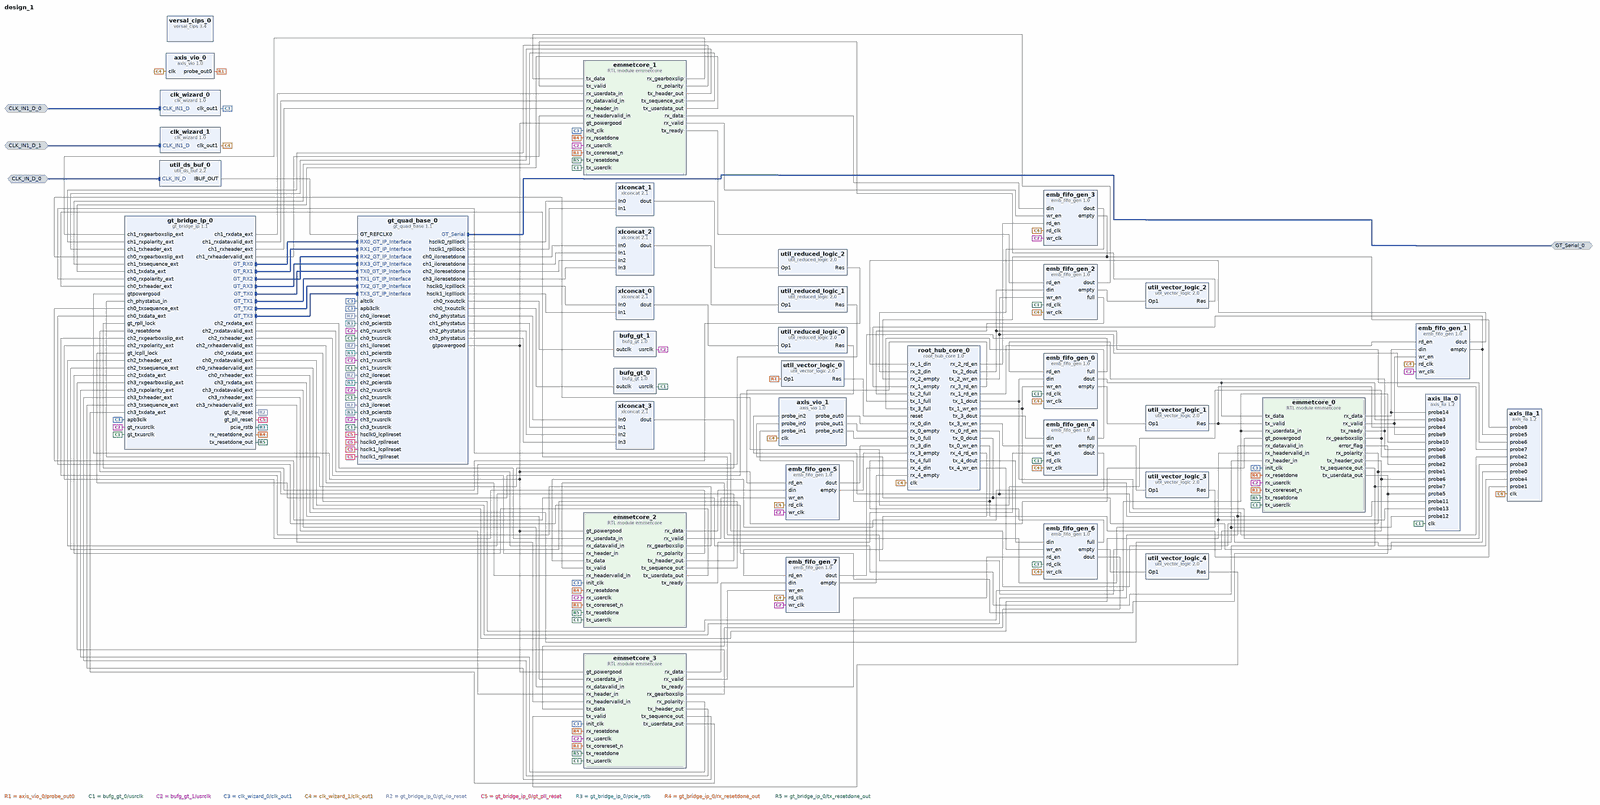
[diagram p0: block diagram of the top level, whole]
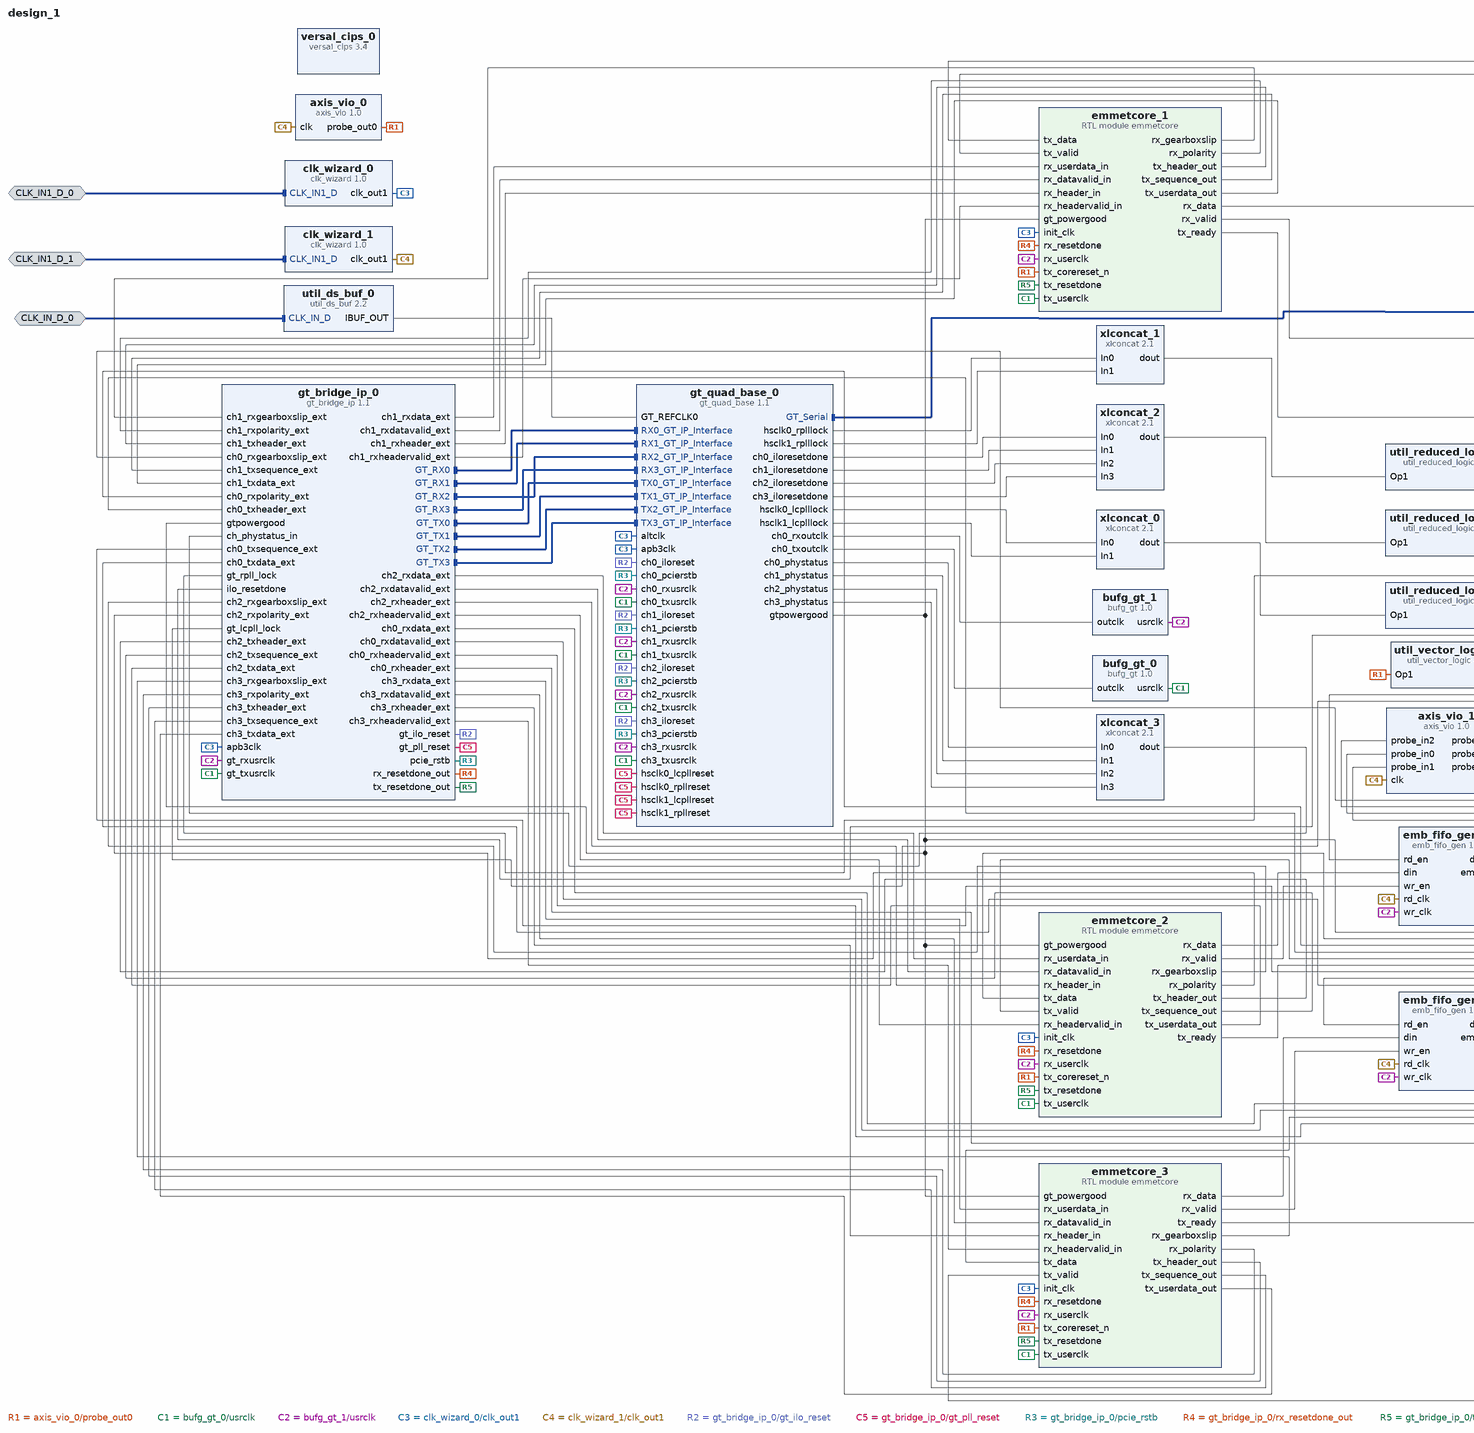
[diagram p1: block diagram of the top level, left part]
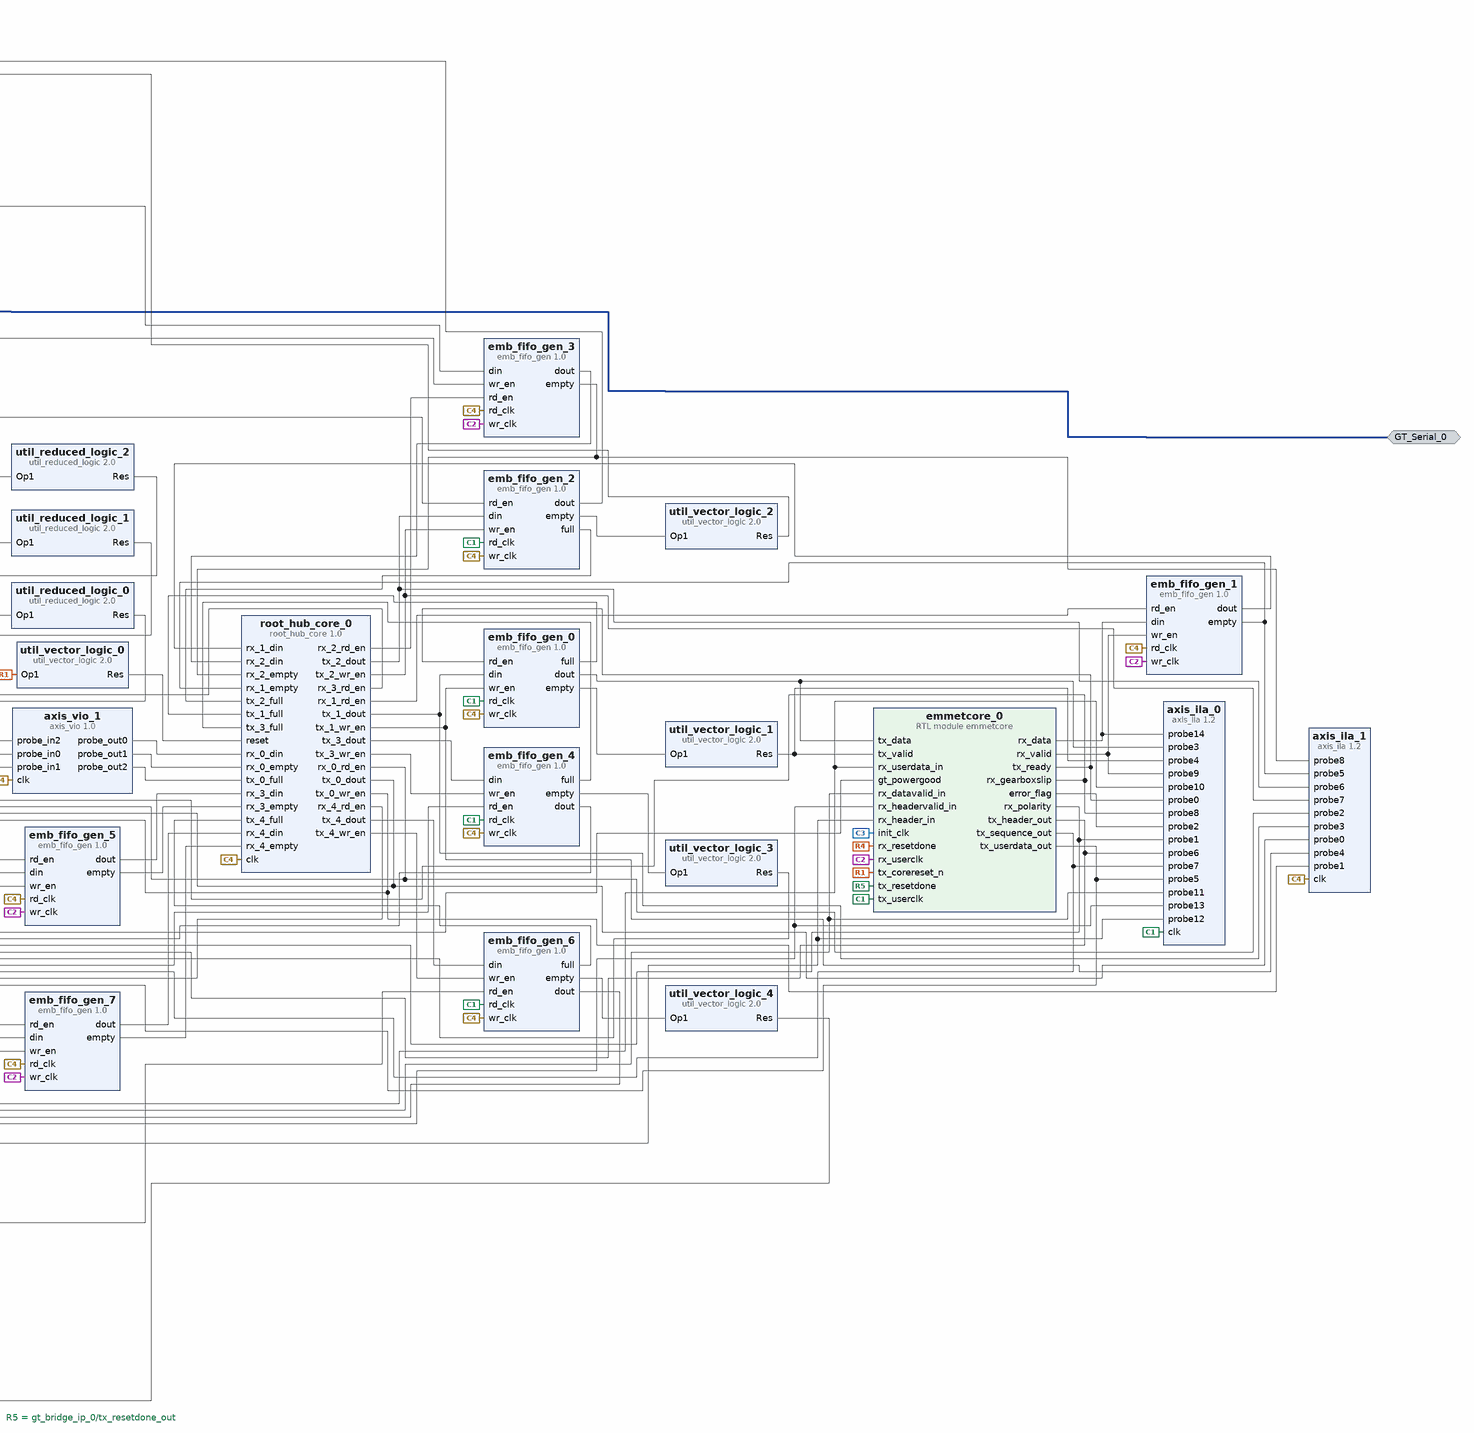
[diagram p2: block diagram of the top level, right part]
# Vivado block design design_1, xcvm1802-vsva2197-2MP-e-S, Vivado 2023.2
create_bd_design design_1

create_bd_intf_port -mode Master -vlnv xilinx.com:interface:gt_rtl:1.0 GT_Serial_0
create_bd_intf_port -mode Slave -vlnv xilinx.com:interface:diff_clock_rtl:1.0 CLK_IN_D_0
create_bd_intf_port -mode Slave -vlnv xilinx.com:interface:diff_clock_rtl:1.0 CLK_IN1_D_0
set_property -dict {CONFIG.FREQ_HZ 200000000} [get_bd_intf_ports CLK_IN1_D_0]
create_bd_intf_port -mode Slave -vlnv xilinx.com:interface:diff_clock_rtl:1.0 CLK_IN1_D_1
set_property -dict {CONFIG.FREQ_HZ 200000000} [get_bd_intf_ports CLK_IN1_D_1]

create_bd_cell -type ip -vlnv xilinx.com:ip:gt_bridge_ip:1.1 gt_bridge_ip_0
set_property -dict [list \
  CONFIG.BYPASS_MODE true \
  CONFIG.IP_LR0_SETTINGS {['PRESET GTY-Aurora_64B66B RX_PAM_SEL NRZ TX_PAM_SEL NRZ TX_HD_EN 0 RX_HD_EN 0 RX_GRAY_BYP true TX_GRAY_BYP true RX_GRAY_LITTLEENDIAN true TX_GRAY_LITTLEENDIAN true RX_PRECODE_BYP true TX_PRECODE_BYP', 'true RX_PRECODE_LITTLEENDIAN false TX_PRECODE_LITTLEENDIAN false INTERNAL_PRESET Aurora_64B66B GT_TYPE GTY GT_DIRECTION DUPLEX TX_LINE_RATE 16 TX_PLL_TYPE LCPLL TX_REFCLK_FREQUENCY 100', 'TX_ACTUAL_REFCLK_FREQUENCY 100.000000000000 TX_FRACN_ENABLED false TX_FRACN_OVRD false TX_FRACN_NUMERATOR 0 TX_REFCLK_SOURCE R0 TX_DATA_ENCODING 64B66B_SYNC TX_USER_DATA_WIDTH 64 TX_INT_DATA_WIDTH 64', 'TX_BUFFER_MODE 1 TX_BUFFER_BYPASS_MODE Fast_Sync TX_PIPM_ENABLE false TX_OUTCLK_SOURCE TXOUTCLKPMA TXPROGDIV_FREQ_ENABLE false TXPROGDIV_FREQ_SOURCE LCPLL TXPROGDIV_FREQ_VAL 250.000000', 'TX_DIFF_SWING_EMPH_MODE CUSTOM TX_64B66B_SCRAMBLER false TX_64B66B_ENCODER false TX_64B66B_CRC false TX_RATE_GROUP A RX_LINE_RATE 16 RX_PLL_TYPE LCPLL RX_REFCLK_FREQUENCY 100', 'RX_ACTUAL_REFCLK_FREQUENCY 100.000000000000 RX_FRACN_ENABLED false RX_FRACN_OVRD false RX_FRACN_NUMERATOR 0 RX_REFCLK_SOURCE R0 RX_DATA_DECODING 64B66B_SYNC RX_USER_DATA_WIDTH 64 RX_INT_DATA_WIDTH 64', 'RX_BUFFER_MODE 1 RX_OUTCLK_SOURCE RXOUTCLKPMA RXPROGDIV_FREQ_ENABLE false RXPROGDIV_FREQ_SOURCE LCPLL RXPROGDIV_FREQ_VAL 250.000000 RXRECCLK_FREQ_ENABLE false RXRECCLK_FREQ_VAL 0 INS_LOSS_NYQ 20', 'RX_EQ_MODE AUTO RX_COUPLING AC RX_TERMINATION PROGRAMMABLE RX_RATE_GROUP A RX_TERMINATION_PROG_VALUE 800 RX_PPM_OFFSET 0 RX_64B66B_DESCRAMBLER false RX_64B66B_DECODER false RX_64B66B_CRC false', 'OOB_ENABLE false RX_COMMA_ALIGN_WORD 1 RX_COMMA_SHOW_REALIGN_ENABLE true PCIE_ENABLE false TX_LANE_DESKEW_HDMI_ENABLE false RX_COMMA_P_ENABLE false RX_COMMA_M_ENABLE false RX_COMMA_DOUBLE_ENABLE false', 'RX_COMMA_P_VAL 0101111100 RX_COMMA_M_VAL 1010000011 RX_COMMA_MASK 0000000000 RX_SLIDE_MODE OFF RX_SSC_PPM 0 RX_CB_NUM_SEQ 0 RX_CB_LEN_SEQ 1 RX_CB_MAX_SKEW 1 RX_CB_MAX_LEVEL 1 RX_CB_MASK_0_0 false', 'RX_CB_VAL_0_0 00000000 RX_CB_K_0_0 false RX_CB_DISP_0_0 false RX_CB_MASK_0_1 false RX_CB_VAL_0_1 00000000 RX_CB_K_0_1 false RX_CB_DISP_0_1 false RX_CB_MASK_0_2 false RX_CB_VAL_0_2 00000000 RX_CB_K_0_2', 'false RX_CB_DISP_0_2 false RX_CB_MASK_0_3 false RX_CB_VAL_0_3 00000000 RX_CB_K_0_3 false RX_CB_DISP_0_3 false RX_CB_MASK_1_0 false RX_CB_VAL_1_0 00000000 RX_CB_K_1_0 false RX_CB_DISP_1_0 false', 'RX_CB_MASK_1_1 false RX_CB_VAL_1_1 00000000 RX_CB_K_1_1 false RX_CB_DISP_1_1 false RX_CB_MASK_1_2 false RX_CB_VAL_1_2 00000000 RX_CB_K_1_2 false RX_CB_DISP_1_2 false RX_CB_MASK_1_3 false RX_CB_VAL_1_3', '00000000 RX_CB_K_1_3 false RX_CB_DISP_1_3 false RX_CC_NUM_SEQ 0 RX_CC_LEN_SEQ 1 RX_CC_PERIODICITY 5000 RX_CC_KEEP_IDLE DISABLE RX_CC_PRECEDENCE ENABLE RX_CC_REPEAT_WAIT 0 RX_CC_VAL', '00000000000000000000000000000000000000000000000000000000000000000000000000000000 RX_CC_MASK_0_0 false RX_CC_VAL_0_0 00000000 RX_CC_K_0_0 false RX_CC_DISP_0_0 false RX_CC_MASK_0_1 false RX_CC_VAL_0_1', '00000000 RX_CC_K_0_1 false RX_CC_DISP_0_1 false RX_CC_MASK_0_2 false RX_CC_VAL_0_2 00000000 RX_CC_K_0_2 false RX_CC_DISP_0_2 false RX_CC_MASK_0_3 false RX_CC_VAL_0_3 00000000 RX_CC_K_0_3 false', 'RX_CC_DISP_0_3 false RX_CC_MASK_1_0 false RX_CC_VAL_1_0 00000000 RX_CC_K_1_0 false RX_CC_DISP_1_0 false RX_CC_MASK_1_1 false RX_CC_VAL_1_1 00000000 RX_CC_K_1_1 false RX_CC_DISP_1_1 false', 'RX_CC_MASK_1_2 false RX_CC_VAL_1_2 00000000 RX_CC_K_1_2 false RX_CC_DISP_1_2 false RX_CC_MASK_1_3 false RX_CC_VAL_1_3 00000000 RX_CC_K_1_3 false RX_CC_DISP_1_3 false PCIE_USERCLK2_FREQ 250', 'PCIE_USERCLK_FREQ 250 RX_JTOL_FC 9.5980804 RX_JTOL_LF_SLOPE -20 RX_BUFFER_BYPASS_MODE Fast_Sync RX_BUFFER_BYPASS_MODE_LANE MULTI RX_BUFFER_RESET_ON_CB_CHANGE ENABLE RX_BUFFER_RESET_ON_COMMAALIGN', 'DISABLE RX_BUFFER_RESET_ON_RATE_CHANGE ENABLE TX_BUFFER_RESET_ON_RATE_CHANGE ENABLE RESET_SEQUENCE_INTERVAL 0 RX_COMMA_PRESET NONE RX_COMMA_VALID_ONLY 0']} \
  CONFIG.IP_NO_OF_LANES 4 \
  CONFIG.IP_PRESET GTY-Aurora_64B66B \
] [get_bd_cells gt_bridge_ip_0]
create_bd_cell -type ip -vlnv xilinx.com:ip:gt_quad_base:1.1 gt_quad_base_0
set_property -dict [list \
  CONFIG.APB3_CLK_FREQUENCY 200.0 \
  CONFIG.BYPASS_DRC_58G false \
  CONFIG.CHANNEL_ORDERING {['/gt_quad_base_0/TX0_GT_IP_Interface design_1_gt_bridge_ip_0_0./gt_bridge_ip_0/GT_TX0.0 /gt_quad_base_0/TX1_GT_IP_Interface design_1_gt_bridge_ip_0_0./gt_bridge_ip_0/GT_TX1.1', '/gt_quad_base_0/TX2_GT_IP_Interface design_1_gt_bridge_ip_0_0./gt_bridge_ip_0/GT_TX2.2 /gt_quad_base_0/TX3_GT_IP_Interface design_1_gt_bridge_ip_0_0./gt_bridge_ip_0/GT_TX3.3', '/gt_quad_base_0/RX0_GT_IP_Interface design_1_gt_bridge_ip_0_0./gt_bridge_ip_0/GT_RX0.0 /gt_quad_base_0/RX1_GT_IP_Interface design_1_gt_bridge_ip_0_0./gt_bridge_ip_0/GT_RX1.1', '/gt_quad_base_0/RX2_GT_IP_Interface design_1_gt_bridge_ip_0_0./gt_bridge_ip_0/GT_RX2.2 /gt_quad_base_0/RX3_GT_IP_Interface design_1_gt_bridge_ip_0_0./gt_bridge_ip_0/GT_RX3.3']} \
  CONFIG.GT_TYPE GTY \
  CONFIG.PORTS_INFO_DICT {LANE_SEL_DICT {PROT0 {RX0 RX1 RX2 RX3 TX0 TX1 TX2 TX3}} GT_TYPE GTY REG_CONF_INTF APB3_INTF BOARD_PARAMETER { }} \
  CONFIG.PROT0_ENABLE true \
  CONFIG.PROT0_GT_DIRECTION DUPLEX \
  CONFIG.PROT0_LR0_SETTINGS {['RX_CB_MASK 00000000 RX_CB_VAL 00000000000000000000000000000000000000000000000000000000000000000000000000000000 RX_CB_K 00000000 RX_CB_DISP 00000000 RX_CC_MASK 00000000 RX_CC_K 00000000 RX_CC_DISP', '00000000 GT_DIRECTION DUPLEX TX_PAM_SEL NRZ TX_HD_EN 0 TX_GRAY_BYP true TX_GRAY_LITTLEENDIAN true TX_PRECODE_BYP true TX_PRECODE_LITTLEENDIAN false TX_LINE_RATE 16 TX_PLL_TYPE LCPLL', 'TX_REFCLK_FREQUENCY 100 TX_ACTUAL_REFCLK_FREQUENCY 100.000000000000 TX_FRACN_ENABLED false TX_FRACN_OVRD false TX_FRACN_NUMERATOR 0 TX_REFCLK_SOURCE R0 TX_DATA_ENCODING 64B66B_SYNC TX_USER_DATA_WIDTH', '64 TX_INT_DATA_WIDTH 64 TX_BUFFER_MODE 1 TX_BUFFER_BYPASS_MODE Fast_Sync TX_PIPM_ENABLE false TX_OUTCLK_SOURCE TXOUTCLKPMA TXPROGDIV_FREQ_ENABLE false TXPROGDIV_FREQ_SOURCE LCPLL TXPROGDIV_FREQ_VAL', '250.000000 TX_DIFF_SWING_EMPH_MODE CUSTOM TX_64B66B_SCRAMBLER false TX_64B66B_ENCODER false TX_64B66B_CRC false TX_RATE_GROUP A TX_LANE_DESKEW_HDMI_ENABLE false TX_BUFFER_RESET_ON_RATE_CHANGE ENABLE', 'PRESET GTY-Aurora_64B66B RX_PAM_SEL NRZ RX_HD_EN 0 RX_GRAY_BYP true RX_GRAY_LITTLEENDIAN true RX_PRECODE_BYP true RX_PRECODE_LITTLEENDIAN false INTERNAL_PRESET Aurora_64B66B RX_LINE_RATE 16', 'RX_PLL_TYPE LCPLL RX_REFCLK_FREQUENCY 100 RX_ACTUAL_REFCLK_FREQUENCY 100.000000000000 RX_FRACN_ENABLED false RX_FRACN_OVRD false RX_FRACN_NUMERATOR 0 RX_REFCLK_SOURCE R0 RX_DATA_DECODING 64B66B_SYNC', 'RX_USER_DATA_WIDTH 64 RX_INT_DATA_WIDTH 64 RX_BUFFER_MODE 1 RX_OUTCLK_SOURCE RXOUTCLKPMA RXPROGDIV_FREQ_ENABLE false RXPROGDIV_FREQ_SOURCE LCPLL RXPROGDIV_FREQ_VAL 250.000000 RXRECCLK_FREQ_ENABLE', 'false RXRECCLK_FREQ_VAL 0 INS_LOSS_NYQ 20 RX_EQ_MODE AUTO RX_COUPLING AC RX_TERMINATION PROGRAMMABLE RX_RATE_GROUP A RX_TERMINATION_PROG_VALUE 800 RX_PPM_OFFSET 0 RX_64B66B_DESCRAMBLER false', 'RX_64B66B_DECODER false RX_64B66B_CRC false OOB_ENABLE false RX_COMMA_ALIGN_WORD 1 RX_COMMA_SHOW_REALIGN_ENABLE true PCIE_ENABLE false RX_COMMA_P_ENABLE false RX_COMMA_M_ENABLE false', 'RX_COMMA_DOUBLE_ENABLE false RX_COMMA_P_VAL 0101111100 RX_COMMA_M_VAL 1010000011 RX_COMMA_MASK 0000000000 RX_SLIDE_MODE OFF RX_SSC_PPM 0 RX_CB_NUM_SEQ 0 RX_CB_LEN_SEQ 1 RX_CB_MAX_SKEW 1', 'RX_CB_MAX_LEVEL 1 RX_CB_MASK_0_0 false RX_CB_VAL_0_0 00000000 RX_CB_K_0_0 false RX_CB_DISP_0_0 false RX_CB_MASK_0_1 false RX_CB_VAL_0_1 00000000 RX_CB_K_0_1 false RX_CB_DISP_0_1 false RX_CB_MASK_0_2', 'false RX_CB_VAL_0_2 00000000 RX_CB_K_0_2 false RX_CB_DISP_0_2 false RX_CB_MASK_0_3 false RX_CB_VAL_0_3 00000000 RX_CB_K_0_3 false RX_CB_DISP_0_3 false RX_CB_MASK_1_0 false RX_CB_VAL_1_0 00000000', 'RX_CB_K_1_0 false RX_CB_DISP_1_0 false RX_CB_MASK_1_1 false RX_CB_VAL_1_1 00000000 RX_CB_K_1_1 false RX_CB_DISP_1_1 false RX_CB_MASK_1_2 false RX_CB_VAL_1_2 00000000 RX_CB_K_1_2 false RX_CB_DISP_1_2', 'false RX_CB_MASK_1_3 false RX_CB_VAL_1_3 00000000 RX_CB_K_1_3 false RX_CB_DISP_1_3 false RX_CC_NUM_SEQ 0 RX_CC_LEN_SEQ 1 RX_CC_PERIODICITY 5000 RX_CC_KEEP_IDLE DISABLE RX_CC_PRECEDENCE ENABLE', 'RX_CC_REPEAT_WAIT 0 RX_CC_VAL 00000000000000000000000000000000000000000000000000000000000000000000000000000000 RX_CC_MASK_0_0 false RX_CC_VAL_0_0 00000000 RX_CC_K_0_0 false RX_CC_DISP_0_0 false', 'RX_CC_MASK_0_1 false RX_CC_VAL_0_1 00000000 RX_CC_K_0_1 false RX_CC_DISP_0_1 false RX_CC_MASK_0_2 false RX_CC_VAL_0_2 00000000 RX_CC_K_0_2 false RX_CC_DISP_0_2 false RX_CC_MASK_0_3 false RX_CC_VAL_0_3', '00000000 RX_CC_K_0_3 false RX_CC_DISP_0_3 false RX_CC_MASK_1_0 false RX_CC_VAL_1_0 00000000 RX_CC_K_1_0 false RX_CC_DISP_1_0 false RX_CC_MASK_1_1 false RX_CC_VAL_1_1 00000000 RX_CC_K_1_1 false', 'RX_CC_DISP_1_1 false RX_CC_MASK_1_2 false RX_CC_VAL_1_2 00000000 RX_CC_K_1_2 false RX_CC_DISP_1_2 false RX_CC_MASK_1_3 false RX_CC_VAL_1_3 00000000 RX_CC_K_1_3 false RX_CC_DISP_1_3 false', 'PCIE_USERCLK2_FREQ 250 PCIE_USERCLK_FREQ 250 RX_JTOL_FC 9.5980804 RX_JTOL_LF_SLOPE -20 RX_BUFFER_BYPASS_MODE Fast_Sync RX_BUFFER_BYPASS_MODE_LANE MULTI RX_BUFFER_RESET_ON_CB_CHANGE ENABLE', 'RX_BUFFER_RESET_ON_COMMAALIGN DISABLE RX_BUFFER_RESET_ON_RATE_CHANGE ENABLE RESET_SEQUENCE_INTERVAL 0 RX_COMMA_PRESET NONE RX_COMMA_VALID_ONLY 0 GT_TYPE GTY']} \
  CONFIG.PROT0_LR10_SETTINGS {NA NA} \
  CONFIG.PROT0_LR11_SETTINGS {NA NA} \
  CONFIG.PROT0_LR12_SETTINGS {NA NA} \
  CONFIG.PROT0_LR13_SETTINGS {NA NA} \
  CONFIG.PROT0_LR14_SETTINGS {NA NA} \
  CONFIG.PROT0_LR15_SETTINGS {NA NA} \
  CONFIG.PROT0_LR1_SETTINGS {NA NA} \
  CONFIG.PROT0_LR2_SETTINGS {NA NA} \
  CONFIG.PROT0_LR3_SETTINGS {NA NA} \
  CONFIG.PROT0_LR4_SETTINGS {NA NA} \
  CONFIG.PROT0_LR5_SETTINGS {NA NA} \
  CONFIG.PROT0_LR6_SETTINGS {NA NA} \
  CONFIG.PROT0_LR7_SETTINGS {NA NA} \
  CONFIG.PROT0_LR8_SETTINGS {NA NA} \
  CONFIG.PROT0_LR9_SETTINGS {NA NA} \
  CONFIG.PROT0_NO_OF_LANES 4 \
  CONFIG.PROT0_RX_MASTERCLK_SRC RX0 \
  CONFIG.PROT0_TX_MASTERCLK_SRC TX0 \
  CONFIG.QUAD_USAGE {['TX_QUAD_CH {', 'TXQuad_0_/gt_quad_base_0 {/gt_quad_base_0 design_1_gt_bridge_ip_0_0.IP_CH0,design_1_gt_bridge_ip_0_0.IP_CH1,design_1_gt_bridge_ip_0_0.IP_CH2,design_1_gt_bridge_ip_0_0.IP_CH3 MSTRCLK 1,0,0,0', 'IS_CURRENT_QUAD 1}', '}', 'RX_QUAD_CH {', 'RXQuad_0_/gt_quad_base_0 {/gt_quad_base_0 design_1_gt_bridge_ip_0_0.IP_CH0,design_1_gt_bridge_ip_0_0.IP_CH1,design_1_gt_bridge_ip_0_0.IP_CH2,design_1_gt_bridge_ip_0_0.IP_CH3 MSTRCLK 1,0,0,0', 'IS_CURRENT_QUAD 1}', '}']} \
  CONFIG.REFCLK_LIST {{/CLK_IN_D_0_clk_p[0]}} \
  CONFIG.REFCLK_STRING {HSCLK0_LCPLLGTREFCLK0 refclk_PROT0_R0_100_MHz_unique1 HSCLK1_LCPLLGTREFCLK0 refclk_PROT0_R0_100_MHz_unique1} \
  CONFIG.REG_CONF_INTF APB3_INTF \
  CONFIG.RX0_LANE_SEL PROT0 \
  CONFIG.RX1_LANE_SEL PROT0 \
  CONFIG.RX2_LANE_SEL PROT0 \
  CONFIG.RX3_LANE_SEL PROT0 \
  CONFIG.TX0_LANE_SEL PROT0 \
  CONFIG.TX1_LANE_SEL PROT0 \
  CONFIG.TX2_LANE_SEL PROT0 \
  CONFIG.TX3_LANE_SEL PROT0 \
] [get_bd_cells gt_quad_base_0]
create_bd_cell -type ip -vlnv xilinx.com:ip:bufg_gt:1.0 bufg_gt_0
create_bd_cell -type ip -vlnv xilinx.com:ip:bufg_gt:1.0 bufg_gt_1
create_bd_cell -type ip -vlnv xilinx.com:ip:clk_wizard:1.0 clk_wizard_0
set_property -dict [list \
  CONFIG.CLKOUT_DRIVES BUFG,BUFG,BUFG,BUFG,BUFG,BUFG,BUFG \
  CONFIG.CLKOUT_DYN_PS None,None,None,None,None,None,None \
  CONFIG.CLKOUT_GROUPING Auto,Auto,Auto,Auto,Auto,Auto,Auto \
  CONFIG.CLKOUT_MATCHED_ROUTING false,false,false,false,false,false,false \
  CONFIG.CLKOUT_PORT clk_out1,clk_out2,clk_out3,clk_out4,clk_out5,clk_out6,clk_out7 \
  CONFIG.CLKOUT_REQUESTED_DUTY_CYCLE 50.000,50.000,50.000,50.000,50.000,50.000,50.000 \
  CONFIG.CLKOUT_REQUESTED_OUT_FREQUENCY 200.000,100.000,100.000,100.000,100.000,100.000,100.000 \
  CONFIG.CLKOUT_REQUESTED_PHASE 0.000,0.000,0.000,0.000,0.000,0.000,0.000 \
  CONFIG.CLKOUT_USED true,false,false,false,false,false,false \
  CONFIG.PRIM_IN_FREQ 200 \
  CONFIG.PRIM_SOURCE Differential_clock_capable_pin \
] [get_bd_cells clk_wizard_0]
create_bd_cell -type ip -vlnv xilinx.com:ip:util_ds_buf:2.2 util_ds_buf_0
set_property -dict {CONFIG.C_BUF_TYPE IBUFDSGTE} [get_bd_cells util_ds_buf_0]
create_bd_cell -type ip -vlnv xilinx.com:ip:xlconcat:2.1 xlconcat_0
create_bd_cell -type ip -vlnv xilinx.com:ip:xlconcat:2.1 xlconcat_1
create_bd_cell -type ip -vlnv xilinx.com:ip:xlconcat:2.1 xlconcat_2
set_property -dict {CONFIG.NUM_PORTS 4} [get_bd_cells xlconcat_2]
create_bd_cell -type ip -vlnv xilinx.com:ip:util_reduced_logic:2.0 util_reduced_logic_0
set_property -dict {CONFIG.C_SIZE 2} [get_bd_cells util_reduced_logic_0]
create_bd_cell -type ip -vlnv xilinx.com:ip:util_reduced_logic:2.0 util_reduced_logic_1
set_property -dict {CONFIG.C_SIZE 4} [get_bd_cells util_reduced_logic_1]
create_bd_cell -type ip -vlnv xilinx.com:ip:util_reduced_logic:2.0 util_reduced_logic_2
set_property -dict {CONFIG.C_SIZE 2} [get_bd_cells util_reduced_logic_2]
create_bd_cell -type ip -vlnv xilinx.com:ip:xlconcat:2.1 xlconcat_3
set_property -dict {CONFIG.NUM_PORTS 4} [get_bd_cells xlconcat_3]
create_bd_cell -type module -reference emmetcore emmetcore_0
create_bd_cell -type ip -vlnv xilinx.com:ip:axis_vio:1.0 axis_vio_0
set_property -dict [list \
  CONFIG.C_NUM_PROBE_IN 0 \
  CONFIG.C_NUM_PROBE_OUT 1 \
  CONFIG.C_PROBE_OUT1_WIDTH 1 \
  CONFIG.C_PROBE_OUT2_WIDTH 1 \
] [get_bd_cells axis_vio_0]
create_bd_cell -type ip -vlnv xilinx.com:ip:clk_wizard:1.0 clk_wizard_1
set_property -dict {CONFIG.PRIM_IN_FREQ 200 CONFIG.PRIM_SOURCE Differential_clock_capable_pin} [get_bd_cells clk_wizard_1]
create_bd_cell -type ip -vlnv xilinx.com:ip:emb_fifo_gen:1.0 emb_fifo_gen_0
set_property -dict [list \
  CONFIG.CDC_SYNC_STAGES 2 \
  CONFIG.CLOCK_DOMAIN Independent_Clock \
  CONFIG.READ_MODE FWFT \
  CONFIG.WRITE_DATA_WIDTH 64 \
] [get_bd_cells emb_fifo_gen_0]
create_bd_cell -type ip -vlnv xilinx.com:ip:util_vector_logic:2.0 util_vector_logic_1
set_property -dict {CONFIG.C_OPERATION not CONFIG.C_SIZE 1} [get_bd_cells util_vector_logic_1]
create_bd_cell -type ip -vlnv xilinx.com:ip:axis_ila:1.2 axis_ila_0
set_property -dict [list \
  CONFIG.C_NUM_OF_PROBES 15 \
  CONFIG.C_PROBE10_WIDTH 64 \
  CONFIG.C_PROBE12_WIDTH 2 \
  CONFIG.C_PROBE14_WIDTH 64 \
  CONFIG.C_PROBE18_WIDTH 1 \
  CONFIG.C_PROBE20_WIDTH 1 \
  CONFIG.C_PROBE22_WIDTH 1 \
  CONFIG.C_PROBE23_WIDTH 1 \
  CONFIG.C_PROBE3_WIDTH 64 \
  CONFIG.C_PROBE5_WIDTH 64 \
  CONFIG.C_PROBE6_WIDTH 2 \
  CONFIG.C_PROBE7_WIDTH 7 \
  CONFIG.C_PROBE8_WIDTH 1 \
] [get_bd_cells axis_ila_0]
create_bd_cell -type ip -vlnv xilinx.com:ip:versal_cips:3.4 versal_cips_0
create_bd_cell -type ip -vlnv user.org:user:root_hub_core:1.0 root_hub_core_0
set_property -dict {CONFIG.NUM_FPGAS 5} [get_bd_cells root_hub_core_0]
create_bd_cell -type ip -vlnv xilinx.com:ip:axis_vio:1.0 axis_vio_1
set_property -dict [list \
  CONFIG.C_NUM_PROBE_IN 3 \
  CONFIG.C_NUM_PROBE_OUT 3 \
  CONFIG.C_PROBE_IN0_WIDTH 64 \
  CONFIG.C_PROBE_OUT0_WIDTH 64 \
] [get_bd_cells axis_vio_1]
create_bd_cell -type ip -vlnv xilinx.com:ip:axis_ila:1.2 axis_ila_1
set_property -dict [list \
  CONFIG.C_NUM_OF_PROBES 9 \
  CONFIG.C_PROBE0_WIDTH 64 \
  CONFIG.C_PROBE3_WIDTH 64 \
  CONFIG.C_PROBE6_WIDTH 64 \
] [get_bd_cells axis_ila_1]
create_bd_cell -type ip -vlnv xilinx.com:ip:emb_fifo_gen:1.0 emb_fifo_gen_1
set_property -dict [list \
  CONFIG.CLOCK_DOMAIN Independent_Clock \
  CONFIG.READ_MODE FWFT \
  CONFIG.WRITE_DATA_WIDTH 64 \
] [get_bd_cells emb_fifo_gen_1]
create_bd_cell -type ip -vlnv xilinx.com:ip:util_vector_logic:2.0 util_vector_logic_0
set_property -dict {CONFIG.C_OPERATION not CONFIG.C_SIZE 1} [get_bd_cells util_vector_logic_0]
create_bd_cell -type module -reference emmetcore emmetcore_1
create_bd_cell -type ip -vlnv xilinx.com:ip:emb_fifo_gen:1.0 emb_fifo_gen_2
set_property -dict [list \
  CONFIG.CLOCK_DOMAIN Independent_Clock \
  CONFIG.READ_MODE FWFT \
  CONFIG.WRITE_DATA_WIDTH 64 \
] [get_bd_cells emb_fifo_gen_2]
create_bd_cell -type ip -vlnv xilinx.com:ip:emb_fifo_gen:1.0 emb_fifo_gen_3
set_property -dict [list \
  CONFIG.CLOCK_DOMAIN Independent_Clock \
  CONFIG.READ_MODE FWFT \
  CONFIG.WRITE_DATA_WIDTH 64 \
] [get_bd_cells emb_fifo_gen_3]
create_bd_cell -type ip -vlnv xilinx.com:ip:util_vector_logic:2.0 util_vector_logic_2
set_property -dict {CONFIG.C_OPERATION not CONFIG.C_SIZE 1} [get_bd_cells util_vector_logic_2]
create_bd_cell -type module -reference emmetcore emmetcore_2
create_bd_cell -type ip -vlnv xilinx.com:ip:emb_fifo_gen:1.0 emb_fifo_gen_4
set_property -dict [list \
  CONFIG.CLOCK_DOMAIN Independent_Clock \
  CONFIG.READ_MODE FWFT \
  CONFIG.WRITE_DATA_WIDTH 64 \
] [get_bd_cells emb_fifo_gen_4]
create_bd_cell -type ip -vlnv xilinx.com:ip:emb_fifo_gen:1.0 emb_fifo_gen_5
set_property -dict [list \
  CONFIG.CLOCK_DOMAIN Independent_Clock \
  CONFIG.READ_MODE FWFT \
  CONFIG.WRITE_DATA_WIDTH 64 \
] [get_bd_cells emb_fifo_gen_5]
create_bd_cell -type ip -vlnv xilinx.com:ip:util_vector_logic:2.0 util_vector_logic_3
set_property -dict {CONFIG.C_OPERATION not CONFIG.C_SIZE 1} [get_bd_cells util_vector_logic_3]
create_bd_cell -type module -reference emmetcore emmetcore_3
create_bd_cell -type ip -vlnv xilinx.com:ip:emb_fifo_gen:1.0 emb_fifo_gen_6
set_property -dict [list \
  CONFIG.CLOCK_DOMAIN Independent_Clock \
  CONFIG.READ_MODE FWFT \
  CONFIG.WRITE_DATA_WIDTH 64 \
] [get_bd_cells emb_fifo_gen_6]
create_bd_cell -type ip -vlnv xilinx.com:ip:emb_fifo_gen:1.0 emb_fifo_gen_7
set_property -dict [list \
  CONFIG.CLOCK_DOMAIN Independent_Clock \
  CONFIG.READ_MODE FWFT \
  CONFIG.WRITE_DATA_WIDTH 64 \
] [get_bd_cells emb_fifo_gen_7]
create_bd_cell -type ip -vlnv xilinx.com:ip:util_vector_logic:2.0 util_vector_logic_4
set_property -dict {CONFIG.C_OPERATION not CONFIG.C_SIZE 1} [get_bd_cells util_vector_logic_4]

# ---- connections ----

connect_bd_intf_net -intf_net CLK_IN1_D_0_1 [get_bd_intf_ports CLK_IN1_D_0] [get_bd_intf_pins clk_wizard_0/CLK_IN1_D]
connect_bd_intf_net -intf_net CLK_IN1_D_1_1 [get_bd_intf_ports CLK_IN1_D_1] [get_bd_intf_pins clk_wizard_1/CLK_IN1_D]
connect_bd_intf_net -intf_net CLK_IN_D_0_1 [get_bd_intf_ports CLK_IN_D_0] [get_bd_intf_pins util_ds_buf_0/CLK_IN_D]
connect_bd_intf_net [get_bd_intf_pins gt_bridge_ip_0/GT_RX0] [get_bd_intf_pins gt_quad_base_0/RX0_GT_IP_Interface]
connect_bd_intf_net [get_bd_intf_pins gt_bridge_ip_0/GT_RX1] [get_bd_intf_pins gt_quad_base_0/RX1_GT_IP_Interface]
connect_bd_intf_net [get_bd_intf_pins gt_bridge_ip_0/GT_RX2] [get_bd_intf_pins gt_quad_base_0/RX2_GT_IP_Interface]
connect_bd_intf_net [get_bd_intf_pins gt_bridge_ip_0/GT_RX3] [get_bd_intf_pins gt_quad_base_0/RX3_GT_IP_Interface]
connect_bd_intf_net [get_bd_intf_pins gt_bridge_ip_0/GT_TX0] [get_bd_intf_pins gt_quad_base_0/TX0_GT_IP_Interface]
connect_bd_intf_net [get_bd_intf_pins gt_bridge_ip_0/GT_TX1] [get_bd_intf_pins gt_quad_base_0/TX1_GT_IP_Interface]
connect_bd_intf_net [get_bd_intf_pins gt_bridge_ip_0/GT_TX2] [get_bd_intf_pins gt_quad_base_0/TX2_GT_IP_Interface]
connect_bd_intf_net [get_bd_intf_pins gt_bridge_ip_0/GT_TX3] [get_bd_intf_pins gt_quad_base_0/TX3_GT_IP_Interface]
connect_bd_intf_net [get_bd_intf_ports GT_Serial_0] [get_bd_intf_pins gt_quad_base_0/GT_Serial]
connect_bd_net [get_bd_pins axis_vio_0/probe_out0] \
  [get_bd_pins util_vector_logic_0/Op1] [get_bd_pins emmetcore_0/tx_corereset_n] [get_bd_pins emmetcore_1/tx_corereset_n] \
  [get_bd_pins emmetcore_2/tx_corereset_n] [get_bd_pins emmetcore_3/tx_corereset_n]
connect_bd_net [get_bd_pins axis_vio_1/probe_out0] [get_bd_pins root_hub_core_0/rx_0_din]
connect_bd_net [get_bd_pins axis_vio_1/probe_out1] [get_bd_pins root_hub_core_0/rx_0_empty]
connect_bd_net [get_bd_pins axis_vio_1/probe_out2] [get_bd_pins root_hub_core_0/tx_0_full]
connect_bd_net [get_bd_pins bufg_gt_0/usrclk] \
  [get_bd_pins gt_bridge_ip_0/gt_txusrclk] [get_bd_pins gt_quad_base_0/ch0_txusrclk] \
  [get_bd_pins gt_quad_base_0/ch3_txusrclk] [get_bd_pins gt_quad_base_0/ch1_txusrclk] \
  [get_bd_pins gt_quad_base_0/ch2_txusrclk] [get_bd_pins emb_fifo_gen_0/rd_clk] [get_bd_pins axis_ila_0/clk] \
  [get_bd_pins emb_fifo_gen_2/rd_clk] [get_bd_pins emb_fifo_gen_4/rd_clk] [get_bd_pins emb_fifo_gen_6/rd_clk] \
  [get_bd_pins emmetcore_0/tx_userclk] [get_bd_pins emmetcore_1/tx_userclk] [get_bd_pins emmetcore_2/tx_userclk] \
  [get_bd_pins emmetcore_3/tx_userclk]
connect_bd_net [get_bd_pins bufg_gt_1/usrclk] \
  [get_bd_pins gt_bridge_ip_0/gt_rxusrclk] [get_bd_pins gt_quad_base_0/ch3_rxusrclk] \
  [get_bd_pins gt_quad_base_0/ch0_rxusrclk] [get_bd_pins gt_quad_base_0/ch2_rxusrclk] \
  [get_bd_pins gt_quad_base_0/ch1_rxusrclk] [get_bd_pins emb_fifo_gen_1/wr_clk] [get_bd_pins emb_fifo_gen_3/wr_clk] \
  [get_bd_pins emb_fifo_gen_5/wr_clk] [get_bd_pins emb_fifo_gen_7/wr_clk] [get_bd_pins emmetcore_0/rx_userclk] \
  [get_bd_pins emmetcore_1/rx_userclk] [get_bd_pins emmetcore_2/rx_userclk] [get_bd_pins emmetcore_3/rx_userclk]
connect_bd_net [get_bd_pins clk_wizard_0/clk_out1] \
  [get_bd_pins gt_quad_base_0/apb3clk] [get_bd_pins gt_bridge_ip_0/apb3clk] [get_bd_pins gt_quad_base_0/altclk] \
  [get_bd_pins emmetcore_0/init_clk] [get_bd_pins emmetcore_1/init_clk] [get_bd_pins emmetcore_2/init_clk] \
  [get_bd_pins emmetcore_3/init_clk]
connect_bd_net [get_bd_pins clk_wizard_1/clk_out1] \
  [get_bd_pins emb_fifo_gen_0/wr_clk] [get_bd_pins axis_vio_0/clk] [get_bd_pins emb_fifo_gen_1/rd_clk] \
  [get_bd_pins axis_ila_1/clk] [get_bd_pins axis_vio_1/clk] [get_bd_pins root_hub_core_0/clk] \
  [get_bd_pins emb_fifo_gen_2/wr_clk] [get_bd_pins emb_fifo_gen_3/rd_clk] [get_bd_pins emb_fifo_gen_4/wr_clk] \
  [get_bd_pins emb_fifo_gen_5/rd_clk] [get_bd_pins emb_fifo_gen_7/rd_clk] [get_bd_pins emb_fifo_gen_6/wr_clk]
connect_bd_net [get_bd_pins emb_fifo_gen_0/dout] [get_bd_pins axis_ila_0/probe3] [get_bd_pins emmetcore_0/tx_data]
connect_bd_net [get_bd_pins emb_fifo_gen_0/empty] [get_bd_pins util_vector_logic_1/Op1]
connect_bd_net [get_bd_pins emb_fifo_gen_0/full] [get_bd_pins root_hub_core_0/tx_1_full]
connect_bd_net [get_bd_pins emb_fifo_gen_1/dout] [get_bd_pins root_hub_core_0/rx_1_din]
connect_bd_net [get_bd_pins emb_fifo_gen_1/empty] [get_bd_pins root_hub_core_0/rx_1_empty] [get_bd_pins axis_ila_1/probe5]
connect_bd_net [get_bd_pins emb_fifo_gen_2/dout] [get_bd_pins emmetcore_1/tx_data]
connect_bd_net [get_bd_pins emb_fifo_gen_2/empty] [get_bd_pins util_vector_logic_2/Op1]
connect_bd_net [get_bd_pins emb_fifo_gen_2/full] [get_bd_pins root_hub_core_0/tx_2_full]
connect_bd_net [get_bd_pins emb_fifo_gen_3/dout] [get_bd_pins root_hub_core_0/rx_2_din]
connect_bd_net [get_bd_pins emb_fifo_gen_3/empty] [get_bd_pins root_hub_core_0/rx_2_empty] [get_bd_pins axis_ila_1/probe8]
connect_bd_net [get_bd_pins emb_fifo_gen_4/dout] [get_bd_pins emmetcore_2/tx_data]
connect_bd_net [get_bd_pins emb_fifo_gen_4/empty] [get_bd_pins util_vector_logic_3/Op1]
connect_bd_net [get_bd_pins emb_fifo_gen_4/full] [get_bd_pins root_hub_core_0/tx_3_full]
connect_bd_net [get_bd_pins emb_fifo_gen_5/dout] [get_bd_pins root_hub_core_0/rx_3_din]
connect_bd_net [get_bd_pins emb_fifo_gen_5/empty] [get_bd_pins root_hub_core_0/rx_3_empty]
connect_bd_net [get_bd_pins emb_fifo_gen_6/dout] [get_bd_pins emmetcore_3/tx_data]
connect_bd_net [get_bd_pins emb_fifo_gen_6/empty] [get_bd_pins util_vector_logic_4/Op1]
connect_bd_net [get_bd_pins emb_fifo_gen_6/full] [get_bd_pins root_hub_core_0/tx_4_full]
connect_bd_net [get_bd_pins emb_fifo_gen_7/dout] [get_bd_pins root_hub_core_0/rx_4_din]
connect_bd_net [get_bd_pins emb_fifo_gen_7/empty] [get_bd_pins root_hub_core_0/rx_4_empty]
connect_bd_net [get_bd_pins emmetcore_0/error_flag] [get_bd_pins axis_ila_0/probe2]
connect_bd_net [get_bd_pins emmetcore_0/rx_data] [get_bd_pins axis_ila_0/probe14] [get_bd_pins emb_fifo_gen_1/din]
connect_bd_net [get_bd_pins emmetcore_0/rx_gearboxslip] [get_bd_pins gt_bridge_ip_0/ch0_rxgearboxslip_ext] [get_bd_pins axis_ila_0/probe8]
connect_bd_net [get_bd_pins emmetcore_0/rx_polarity] [get_bd_pins gt_bridge_ip_0/ch0_rxpolarity_ext] [get_bd_pins axis_ila_0/probe1]
connect_bd_net [get_bd_pins emmetcore_0/rx_valid] [get_bd_pins emb_fifo_gen_1/wr_en] [get_bd_pins axis_ila_0/probe9]
connect_bd_net [get_bd_pins emmetcore_0/tx_header_out] [get_bd_pins gt_bridge_ip_0/ch0_txheader_ext] [get_bd_pins axis_ila_0/probe6]
connect_bd_net [get_bd_pins emmetcore_0/tx_ready] [get_bd_pins emb_fifo_gen_0/rd_en] [get_bd_pins axis_ila_0/probe0]
connect_bd_net [get_bd_pins emmetcore_0/tx_sequence_out] [get_bd_pins gt_bridge_ip_0/ch0_txsequence_ext] [get_bd_pins axis_ila_0/probe7]
connect_bd_net [get_bd_pins emmetcore_0/tx_userdata_out] [get_bd_pins gt_bridge_ip_0/ch0_txdata_ext] [get_bd_pins axis_ila_0/probe5]
connect_bd_net [get_bd_pins emmetcore_1/rx_data] [get_bd_pins emb_fifo_gen_3/din]
connect_bd_net [get_bd_pins emmetcore_1/rx_gearboxslip] [get_bd_pins gt_bridge_ip_0/ch1_rxgearboxslip_ext]
connect_bd_net [get_bd_pins emmetcore_1/rx_polarity] [get_bd_pins gt_bridge_ip_0/ch1_rxpolarity_ext]
connect_bd_net [get_bd_pins emmetcore_1/rx_valid] [get_bd_pins emb_fifo_gen_3/wr_en]
connect_bd_net [get_bd_pins emmetcore_1/tx_header_out] [get_bd_pins gt_bridge_ip_0/ch1_txheader_ext]
connect_bd_net [get_bd_pins emmetcore_1/tx_ready] [get_bd_pins emb_fifo_gen_2/rd_en]
connect_bd_net [get_bd_pins emmetcore_1/tx_sequence_out] [get_bd_pins gt_bridge_ip_0/ch1_txsequence_ext]
connect_bd_net [get_bd_pins emmetcore_1/tx_userdata_out] [get_bd_pins gt_bridge_ip_0/ch1_txdata_ext]
connect_bd_net [get_bd_pins emmetcore_2/rx_data] [get_bd_pins emb_fifo_gen_5/din]
connect_bd_net [get_bd_pins emmetcore_2/rx_gearboxslip] [get_bd_pins gt_bridge_ip_0/ch2_rxgearboxslip_ext]
connect_bd_net [get_bd_pins emmetcore_2/rx_polarity] [get_bd_pins gt_bridge_ip_0/ch2_rxpolarity_ext]
connect_bd_net [get_bd_pins emmetcore_2/rx_valid] [get_bd_pins emb_fifo_gen_5/wr_en]
connect_bd_net [get_bd_pins emmetcore_2/tx_header_out] [get_bd_pins gt_bridge_ip_0/ch2_txheader_ext]
connect_bd_net [get_bd_pins emmetcore_2/tx_ready] [get_bd_pins emb_fifo_gen_4/rd_en]
connect_bd_net [get_bd_pins emmetcore_2/tx_sequence_out] [get_bd_pins gt_bridge_ip_0/ch2_txsequence_ext]
connect_bd_net [get_bd_pins emmetcore_2/tx_userdata_out] [get_bd_pins gt_bridge_ip_0/ch2_txdata_ext]
connect_bd_net [get_bd_pins emmetcore_3/rx_data] [get_bd_pins emb_fifo_gen_7/din]
connect_bd_net [get_bd_pins emmetcore_3/rx_gearboxslip] [get_bd_pins gt_bridge_ip_0/ch3_rxgearboxslip_ext]
connect_bd_net [get_bd_pins emmetcore_3/rx_polarity] [get_bd_pins gt_bridge_ip_0/ch3_rxpolarity_ext]
connect_bd_net [get_bd_pins emmetcore_3/rx_valid] [get_bd_pins emb_fifo_gen_7/wr_en]
connect_bd_net [get_bd_pins emmetcore_3/tx_header_out] [get_bd_pins gt_bridge_ip_0/ch3_txheader_ext]
connect_bd_net [get_bd_pins emmetcore_3/tx_ready] [get_bd_pins emb_fifo_gen_6/rd_en]
connect_bd_net [get_bd_pins emmetcore_3/tx_sequence_out] [get_bd_pins gt_bridge_ip_0/ch3_txsequence_ext]
connect_bd_net [get_bd_pins emmetcore_3/tx_userdata_out] [get_bd_pins gt_bridge_ip_0/ch3_txdata_ext]
connect_bd_net [get_bd_pins gt_bridge_ip_0/ch0_rxdata_ext] [get_bd_pins axis_ila_0/probe10] [get_bd_pins emmetcore_0/rx_userdata_in]
connect_bd_net [get_bd_pins gt_bridge_ip_0/ch0_rxdatavalid_ext] [get_bd_pins axis_ila_0/probe11] [get_bd_pins emmetcore_0/rx_datavalid_in]
connect_bd_net [get_bd_pins gt_bridge_ip_0/ch0_rxheadervalid_ext] [get_bd_pins axis_ila_0/probe13] [get_bd_pins emmetcore_0/rx_headervalid_in]
connect_bd_net [get_bd_pins gt_bridge_ip_0/ch1_rxdata_ext] [get_bd_pins emmetcore_1/rx_userdata_in]
connect_bd_net [get_bd_pins gt_bridge_ip_0/ch1_rxdatavalid_ext] [get_bd_pins emmetcore_1/rx_datavalid_in]
connect_bd_net [get_bd_pins gt_bridge_ip_0/ch1_rxheader_ext] [get_bd_pins emmetcore_1/rx_header_in]
connect_bd_net [get_bd_pins gt_bridge_ip_0/ch1_rxheadervalid_ext] [get_bd_pins emmetcore_1/rx_headervalid_in]
connect_bd_net [get_bd_pins gt_bridge_ip_0/ch2_rxdata_ext] [get_bd_pins emmetcore_2/rx_userdata_in]
connect_bd_net [get_bd_pins gt_bridge_ip_0/ch2_rxdatavalid_ext] [get_bd_pins emmetcore_2/rx_datavalid_in]
connect_bd_net [get_bd_pins gt_bridge_ip_0/ch2_rxheader_ext] [get_bd_pins emmetcore_2/rx_header_in]
connect_bd_net [get_bd_pins gt_bridge_ip_0/ch2_rxheadervalid_ext] [get_bd_pins emmetcore_2/rx_headervalid_in]
connect_bd_net [get_bd_pins gt_bridge_ip_0/ch3_rxdata_ext] [get_bd_pins emmetcore_3/rx_userdata_in]
connect_bd_net [get_bd_pins gt_bridge_ip_0/ch3_rxdatavalid_ext] [get_bd_pins emmetcore_3/rx_datavalid_in]
connect_bd_net [get_bd_pins gt_bridge_ip_0/ch3_rxheader_ext] [get_bd_pins emmetcore_3/rx_header_in]
connect_bd_net [get_bd_pins gt_bridge_ip_0/ch3_rxheadervalid_ext] [get_bd_pins emmetcore_3/rx_headervalid_in]
connect_bd_net [get_bd_pins gt_bridge_ip_0/gt_ilo_reset] \
  [get_bd_pins gt_quad_base_0/ch0_iloreset] [get_bd_pins gt_quad_base_0/ch1_iloreset] \
  [get_bd_pins gt_quad_base_0/ch2_iloreset] [get_bd_pins gt_quad_base_0/ch3_iloreset]
connect_bd_net [get_bd_pins gt_bridge_ip_0/gt_pll_reset] \
  [get_bd_pins gt_quad_base_0/hsclk0_lcpllreset] [get_bd_pins gt_quad_base_0/hsclk0_rpllreset] \
  [get_bd_pins gt_quad_base_0/hsclk1_lcpllreset] [get_bd_pins gt_quad_base_0/hsclk1_rpllreset]
connect_bd_net [get_bd_pins gt_bridge_ip_0/pcie_rstb] \
  [get_bd_pins gt_quad_base_0/ch0_pcierstb] [get_bd_pins gt_quad_base_0/ch1_pcierstb] \
  [get_bd_pins gt_quad_base_0/ch2_pcierstb] [get_bd_pins gt_quad_base_0/ch3_pcierstb]
connect_bd_net [get_bd_pins gt_bridge_ip_0/rx_resetdone_out] \
  [get_bd_pins emmetcore_0/rx_resetdone] [get_bd_pins emmetcore_1/rx_resetdone] [get_bd_pins emmetcore_2/rx_resetdone] \
  [get_bd_pins emmetcore_3/rx_resetdone]
connect_bd_net [get_bd_pins gt_bridge_ip_0/tx_resetdone_out] \
  [get_bd_pins emmetcore_0/tx_resetdone] [get_bd_pins emmetcore_1/tx_resetdone] [get_bd_pins emmetcore_2/tx_resetdone] \
  [get_bd_pins emmetcore_3/tx_resetdone]
connect_bd_net [get_bd_pins gt_quad_base_0/ch0_iloresetdone] [get_bd_pins xlconcat_2/In0]
connect_bd_net [get_bd_pins gt_quad_base_0/ch0_phystatus] [get_bd_pins xlconcat_3/In0]
connect_bd_net [get_bd_pins gt_quad_base_0/ch0_rxoutclk] [get_bd_pins bufg_gt_1/outclk]
connect_bd_net [get_bd_pins gt_quad_base_0/ch0_txoutclk] [get_bd_pins bufg_gt_0/outclk]
connect_bd_net [get_bd_pins gt_quad_base_0/ch1_iloresetdone] [get_bd_pins xlconcat_2/In1]
connect_bd_net [get_bd_pins gt_quad_base_0/ch1_phystatus] [get_bd_pins xlconcat_3/In1]
connect_bd_net [get_bd_pins gt_quad_base_0/ch2_iloresetdone] [get_bd_pins xlconcat_2/In2]
connect_bd_net [get_bd_pins gt_quad_base_0/ch2_phystatus] [get_bd_pins xlconcat_3/In2]
connect_bd_net [get_bd_pins gt_quad_base_0/ch3_iloresetdone] [get_bd_pins xlconcat_2/In3]
connect_bd_net [get_bd_pins gt_quad_base_0/ch3_phystatus] [get_bd_pins xlconcat_3/In3]
connect_bd_net [get_bd_pins gt_quad_base_0/gtpowergood] \
  [get_bd_pins gt_bridge_ip_0/gtpowergood] [get_bd_pins emmetcore_0/gt_powergood] [get_bd_pins emmetcore_1/gt_powergood] \
  [get_bd_pins emmetcore_2/gt_powergood] [get_bd_pins emmetcore_3/gt_powergood]
connect_bd_net [get_bd_pins gt_quad_base_0/hsclk0_lcplllock] [get_bd_pins xlconcat_0/In0]
connect_bd_net [get_bd_pins gt_quad_base_0/hsclk0_rplllock] [get_bd_pins xlconcat_1/In0]
connect_bd_net [get_bd_pins gt_quad_base_0/hsclk1_lcplllock] [get_bd_pins xlconcat_0/In1]
connect_bd_net [get_bd_pins gt_quad_base_0/hsclk1_rplllock] [get_bd_pins xlconcat_1/In1]
connect_bd_net -net inverter_0_rx_header_out [get_bd_pins gt_bridge_ip_0/ch0_rxheader_ext] \
  [get_bd_pins axis_ila_0/probe12] [get_bd_pins emmetcore_0/rx_header_in]
connect_bd_net [get_bd_pins root_hub_core_0/rx_0_rd_en] [get_bd_pins axis_vio_1/probe_in2] [get_bd_pins axis_ila_1/probe2]
connect_bd_net [get_bd_pins root_hub_core_0/rx_1_rd_en] [get_bd_pins emb_fifo_gen_1/rd_en]
connect_bd_net [get_bd_pins root_hub_core_0/rx_2_rd_en] [get_bd_pins emb_fifo_gen_3/rd_en]
connect_bd_net [get_bd_pins root_hub_core_0/rx_3_rd_en] [get_bd_pins emb_fifo_gen_5/rd_en]
connect_bd_net [get_bd_pins root_hub_core_0/rx_4_rd_en] [get_bd_pins emb_fifo_gen_7/rd_en]
connect_bd_net [get_bd_pins root_hub_core_0/tx_0_dout] [get_bd_pins axis_vio_1/probe_in0] [get_bd_pins axis_ila_1/probe0]
connect_bd_net [get_bd_pins root_hub_core_0/tx_0_wr_en] [get_bd_pins axis_vio_1/probe_in1] [get_bd_pins axis_ila_1/probe1]
connect_bd_net [get_bd_pins root_hub_core_0/tx_1_dout] [get_bd_pins emb_fifo_gen_0/din] [get_bd_pins axis_ila_1/probe3]
connect_bd_net [get_bd_pins root_hub_core_0/tx_1_wr_en] [get_bd_pins emb_fifo_gen_0/wr_en] [get_bd_pins axis_ila_1/probe4]
connect_bd_net [get_bd_pins root_hub_core_0/tx_2_dout] [get_bd_pins emb_fifo_gen_2/din] [get_bd_pins axis_ila_1/probe6]
connect_bd_net [get_bd_pins root_hub_core_0/tx_2_wr_en] [get_bd_pins emb_fifo_gen_2/wr_en] [get_bd_pins axis_ila_1/probe7]
connect_bd_net [get_bd_pins root_hub_core_0/tx_3_dout] [get_bd_pins emb_fifo_gen_4/din]
connect_bd_net [get_bd_pins root_hub_core_0/tx_3_wr_en] [get_bd_pins emb_fifo_gen_4/wr_en]
connect_bd_net [get_bd_pins root_hub_core_0/tx_4_dout] [get_bd_pins emb_fifo_gen_6/din]
connect_bd_net [get_bd_pins root_hub_core_0/tx_4_wr_en] [get_bd_pins emb_fifo_gen_6/wr_en]
connect_bd_net [get_bd_pins util_ds_buf_0/IBUF_OUT] [get_bd_pins gt_quad_base_0/GT_REFCLK0]
connect_bd_net [get_bd_pins util_reduced_logic_0/Res] [get_bd_pins gt_bridge_ip_0/gt_lcpll_lock]
connect_bd_net [get_bd_pins util_reduced_logic_1/Res] [get_bd_pins gt_bridge_ip_0/ilo_resetdone]
connect_bd_net [get_bd_pins util_reduced_logic_2/Res] [get_bd_pins gt_bridge_ip_0/gt_rpll_lock]
connect_bd_net [get_bd_pins util_vector_logic_0/Res] [get_bd_pins root_hub_core_0/reset]
connect_bd_net [get_bd_pins util_vector_logic_1/Res] [get_bd_pins axis_ila_0/probe4] [get_bd_pins emmetcore_0/tx_valid]
connect_bd_net [get_bd_pins util_vector_logic_2/Res] [get_bd_pins emmetcore_1/tx_valid]
connect_bd_net [get_bd_pins util_vector_logic_3/Res] [get_bd_pins emmetcore_2/tx_valid]
connect_bd_net [get_bd_pins util_vector_logic_4/Res] [get_bd_pins emmetcore_3/tx_valid]
connect_bd_net [get_bd_pins xlconcat_0/dout] [get_bd_pins util_reduced_logic_0/Op1]
connect_bd_net [get_bd_pins xlconcat_1/dout] [get_bd_pins util_reduced_logic_2/Op1]
connect_bd_net [get_bd_pins xlconcat_2/dout] [get_bd_pins util_reduced_logic_1/Op1]
connect_bd_net [get_bd_pins xlconcat_3/dout] [get_bd_pins gt_bridge_ip_0/ch_phystatus_in]

validate_bd_design
save_bd_design
